# Altium schematic sheet Output.SchDoc
size A4
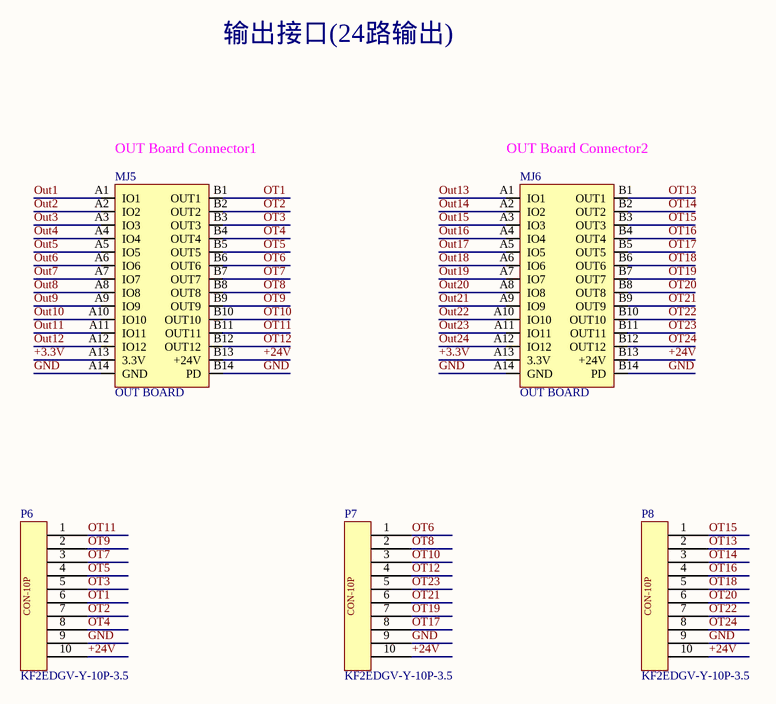
[diagram p0: Output.SchDoc]

## Parts
MJ5  OUT BOARD  [OUT BOARD]
MJ6  OUT BOARD  [OUT BOARD]
P6  KF2EDGV-Y-10P-3.5  [KF2EDGV-Y-10P-3.5]
P7  KF2EDGV-Y-10P-3.5  [KF2EDGV-Y-10P-3.5]
P8  KF2EDGV-Y-10P-3.5  [KF2EDGV-Y-10P-3.5]

## Nets
+3.3V: MJ5.A13(3.3V) MJ6.A13(3.3V)
+24V: MJ5.B13(+24V) MJ6.B13(+24V) P6.10 P7.10 P8.10
GND: MJ5.A14(GND) MJ5.B14(PD) MJ6.A14(GND) MJ6.B14(PD) P6.9 P7.9 P8.9
OT1: MJ5.B1(OUT1) P6.6
OT2: MJ5.B2(OUT2) P6.7
OT3: MJ5.B3(OUT3) P6.5
OT4: MJ5.B4(OUT4) P6.8
OT5: MJ5.B5(OUT5) P6.4
OT6: MJ5.B6(OUT6) P7.1
OT7: MJ5.B7(OUT7) P6.3
OT8: MJ5.B8(OUT8) P7.2
OT9: MJ5.B9(OUT9) P6.2
OT10: MJ5.B10(OUT10) P7.3
OT11: MJ5.B11(OUT11) P6.1
OT12: MJ5.B12(OUT12) P7.4
OT13: MJ6.B1(OUT1) P8.2
OT14: MJ6.B2(OUT2) P8.3
OT15: MJ6.B3(OUT3) P8.1
OT16: MJ6.B4(OUT4) P8.4
OT17: MJ6.B5(OUT5) P7.8
OT18: MJ6.B6(OUT6) P8.5
OT19: MJ6.B7(OUT7) P7.7
OT20: MJ6.B8(OUT8) P8.6
OT21: MJ6.B9(OUT9) P7.6
OT22: MJ6.B10(OUT10) P8.7
OT23: MJ6.B11(OUT11) P7.5
OT24: MJ6.B12(OUT12) P8.8
Out1: MJ5.A1(IO1)
Out2: MJ5.A2(IO2)
Out3: MJ5.A3(IO3)
Out4: MJ5.A4(IO4)
Out5: MJ5.A5(IO5)
Out6: MJ5.A6(IO6)
Out7: MJ5.A7(IO7)
Out8: MJ5.A8(IO8)
Out9: MJ5.A9(IO9)
Out10: MJ5.A10(IO10)
Out11: MJ5.A11(IO11)
Out12: MJ5.A12(IO12)
Out13: MJ6.A1(IO1)
Out14: MJ6.A2(IO2)
Out15: MJ6.A3(IO3)
Out16: MJ6.A4(IO4)
Out17: MJ6.A5(IO5)
Out18: MJ6.A6(IO6)
Out19: MJ6.A7(IO7)
Out20: MJ6.A8(IO8)
Out21: MJ6.A9(IO9)
Out22: MJ6.A10(IO10)
Out23: MJ6.A11(IO11)
Out24: MJ6.A12(IO12)

## Notes on the sheet
- 输出接口(24路输出)
- (near MJ5) OUT Board Connector1
- (near MJ6) OUT Board Connector2

## Library data of the parts
MJ5 MJ6 = J-OUTPUT
P6-P8 = CON-10P